# Altium schematic sheet Power2.SchDoc
size A; SheetNumber: 9; SheetTotal: 10
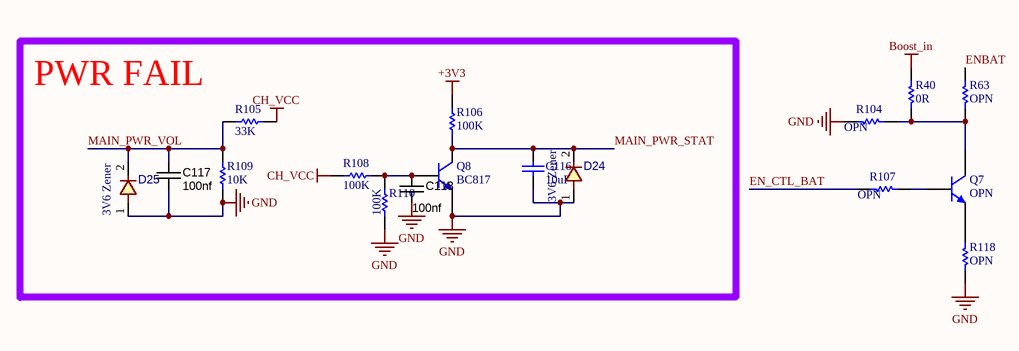
[diagram p0: Power2.SchDoc]

## Parts
C116  10uF  [CAPC3413X12N]
C117  100nf  [CAPC1608X90N]
C118  100nf  [CAPC1608X90N]
D24  value 3V6 Zener  [D_SOD80]  (hidden comment: 5Z1)
D25  value 3V6 Zener  [D_SOD80]  (hidden comment: 5Z1)
Q7  OPN  [SOT23_N]
Q8  BC817  [SOT23_N]
R40  0R  [R0603]
R63  OPN  [R0603]
R104  OPN  [R0603]
R105  33K  [Resistor_SMD_0603 (1608)]
R106  100K  [Resistor_SMD_0603 (1608)]
R107  OPN  [R0603]
R108  100K  [Resistor_SMD_0603 (1608)]
R109  10K  [Resistor_SMD_0603 (1608)]
R110  100K  [Resistor_SMD_0603 (1608)]
R118  OPN  [R0603]

## Nets
+3V3: R106.1
Boost_in: R40.1
CH_VCC: R105.2 R108.1
GND: C116.1 C117.2 C118.2 D24.1 D25.1 Q8.2(E) R104.2 R109.1 R110.1 R118.2
EN_CTL_BAT: R107.2
ENBAT: R63.1
MAIN_PWR_STAT: C116.2 D24.2 Q8.3(C) R106.2
MAIN_PWR_VOL: C117.1 D25.2 R105.1 R109.2
NetC118_1: C118.1 Q8.1(B) R108.2 R110.2
NetQ7_1: Q7.1(B) R107.1
NetQ7_2: Q7.2(E) R118.1
NetQ7_3: Q7.3(C) R40.2 R63.2 R104.1

## Notes on the sheet
- PWR FAIL

## Library data of the parts
C116 = CAP SMD 0805: CAP 0805; Designer: Abbas Basereh; Desc.: CAP SMD 0805; Data: 16-12-2016
C117 C118 = CAPC_100n_0603_X7R_50V_10%: Capacitor SMD Cer 100nF 10% 50V X7R 0603; Manufacturer 1: AVX Corporation; Manufacturer Part Number 1: 06035C104KAT2A; Ratings: 50V; X7R; Material: ceramic; SCDType: spec; Value: 100n; Manufacturer 2: TDK Corporation; Manufacturer Part Number 2: C1608X7R1H104K; Package / Case: 0603 (1608 Metric); Tolerance: ±10%; Supplier 1: Digi-Key; Supplier Part Number 1: 478-5052-1-ND; ComponentLink1URL: http://www.avx.com/docs/Catalogs/cx7r.pdf; ComponentLink1Description: http://www.avx.com/docs/Catalogs/cx7r.pdf; Supplier 2: Digi-Key; Supplier Part Number 2: 445-1314-1-ND; ComponentLink2URL: http://product.tdk.com/capacitor/mlcc/en/documents/mlcc_commercial_general_en.pdf; ComponentLink2Description: http://product.tdk.com/capacitor/mlcc/en/documents/mlcc_commercial_general_en.pdf
D24 D25 = 1N4148 SMD: DIODE, FAST SWTICHING, 0.3A, 0.5W
Q7 Q8 = C945: NPN Silicon Epitaxial Planar Transistor; Published: 2017-2-8; LatestRevisionDate: 2017; LatestRevisionNote: IPC-7351 Footprint Added.; DatasheetVersion: 2017; PackageVersion: 2017-2-8; PackageReference: SOT23; Publisher: Abbas Basereh; PackageDescription: 3-Pin SOT-23 Package 0.95 mm Pitch, 2.3 mm Lead Span; ComponentLink1Description: Manufacturer Link; ComponentLink1URL: http://www.taitroncomponents.com/; ComponentLink2Description: Datasheet; ComponentLink2URL: http://www.taitroncomponents.com/
R40 R63 R104 R107 R118 = Resistor SMD 0603
R105 R106 R108 R110 = Resistor: Resistor 0603; Email: razi.vesali@gmail.com; Value: 10k; Published: 17-Jun-2016; LatestRevisionNote: Re-released for puplic; Publisher: Seyed Razi Vesali
R109 = Resistor: Resistor0603; Email: razi.vesali@gmail.com; Published: 17-Jun-2016; LatestRevisionNote: Re-released for puplic; Publisher: Seyed Razi Vesali; Value: 10k